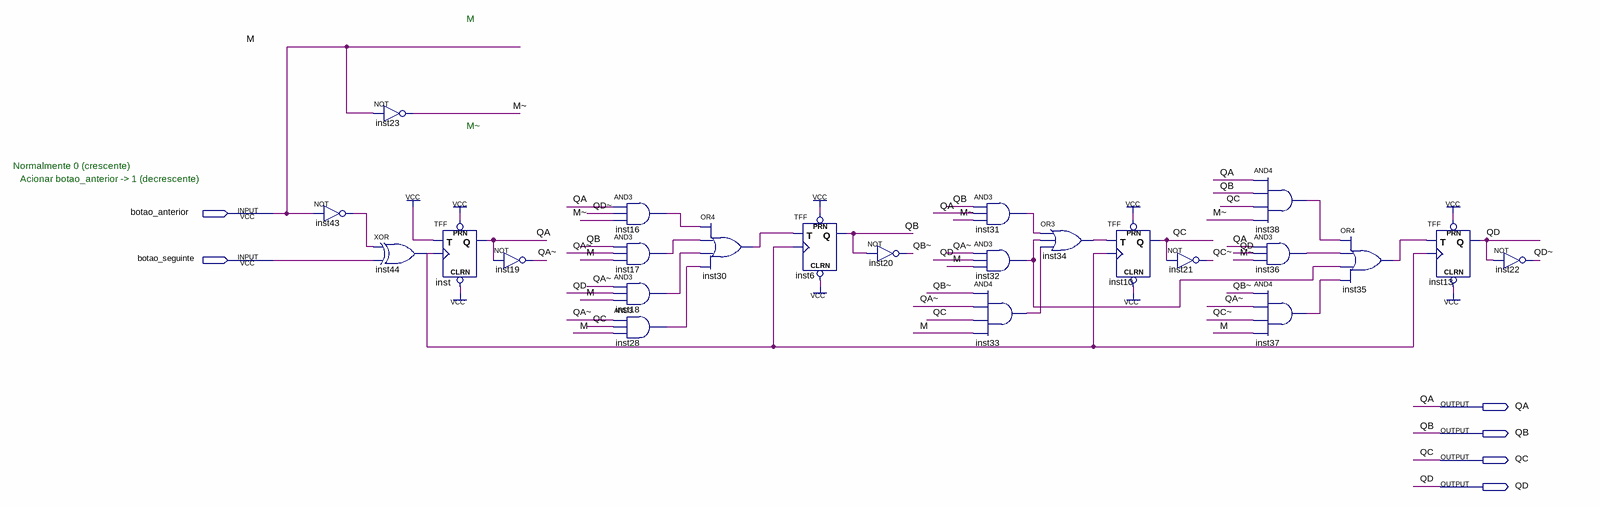
[diagram p0: schematic sheet]
// Quartus schematic Contador_updown.bdf as structural Verilog: 24 symbols, 6 pins
module Contador_updown (
  input  botao_anterior,
  input  botao_seguinte,
  output QA,
  output QB,
  output QC,
  output QD
);

  wire inst16_out, inst17_out, inst18_out, inst28_out, inst30_out, inst31_out, inst32_out, inst33_out,
       inst34_out, inst35_out, inst36_out, inst37_out, inst38_out, inst43_out, inst44_out, \M~ , \QA~ ,
       \QB~ , \QC~ , \QD~ ;

  not inst43 (inst43_out, botao_anterior);
  not inst23 (\M~ , botao_anterior);
  xor inst44 (inst44_out, inst43_out, botao_seguinte);
  TFF inst (.PRN(1'b1), .CLRN(1'b1), .T(1'b1), .CLK(inst44_out), .Q(QA));
  not inst19 (\QA~ , QA);
  and inst16 (inst16_out, QA, \QD~ , \M~ );
  and inst17 (inst17_out, QB, \QA~ , botao_anterior);
  and inst18 (inst18_out, \QA~ , QD, botao_anterior);
  and inst28 (inst28_out, \QA~ , QC, botao_anterior);
  or inst30 (inst30_out, inst16_out, inst17_out, inst18_out, inst28_out);
  TFF inst6 (.PRN(1'b1), .CLRN(1'b1), .T(inst30_out), .CLK(inst44_out), .Q(QB));
  not inst20 (\QB~ , QB);
  and inst31 (inst31_out, QB, QA, \M~ );
  and inst32 (inst32_out, \QA~ , QD, botao_anterior);
  and inst33 (inst33_out, \QB~ , \QA~ , QC, botao_anterior);
  or inst34 (inst34_out, inst31_out, inst32_out, inst33_out);
  TFF inst10 (.PRN(1'b1), .CLRN(1'b1), .T(inst34_out), .CLK(inst44_out), .Q(QC));
  not inst21 (\QC~ , QC);
  and inst38 (inst38_out, QA, QB, QC, \M~ );
  and inst36 (inst36_out, QA, QD, \M~ );
  and inst37 (inst37_out, \QB~ , \QA~ , \QC~ , botao_anterior);
  or inst35 (inst35_out, inst38_out, inst36_out, inst32_out, inst37_out);
  TFF inst13 (.PRN(1'b1), .CLRN(1'b1), .T(inst35_out), .CLK(inst44_out), .Q(QD));
  not inst22 (\QD~ , QD);

  // Other names for the same wires on the sheet: M = botao_anterior

  // Notes on the sheet:
  //   M
  //   M~
  //   Normalmente 0 (crescente)
  //   Acionar botao_anterior -> 1 (decrescente)
endmodule
